# EAGLE design FilamentRecycle (EAGLE 6.6.0)

## Sheet 1 of 3
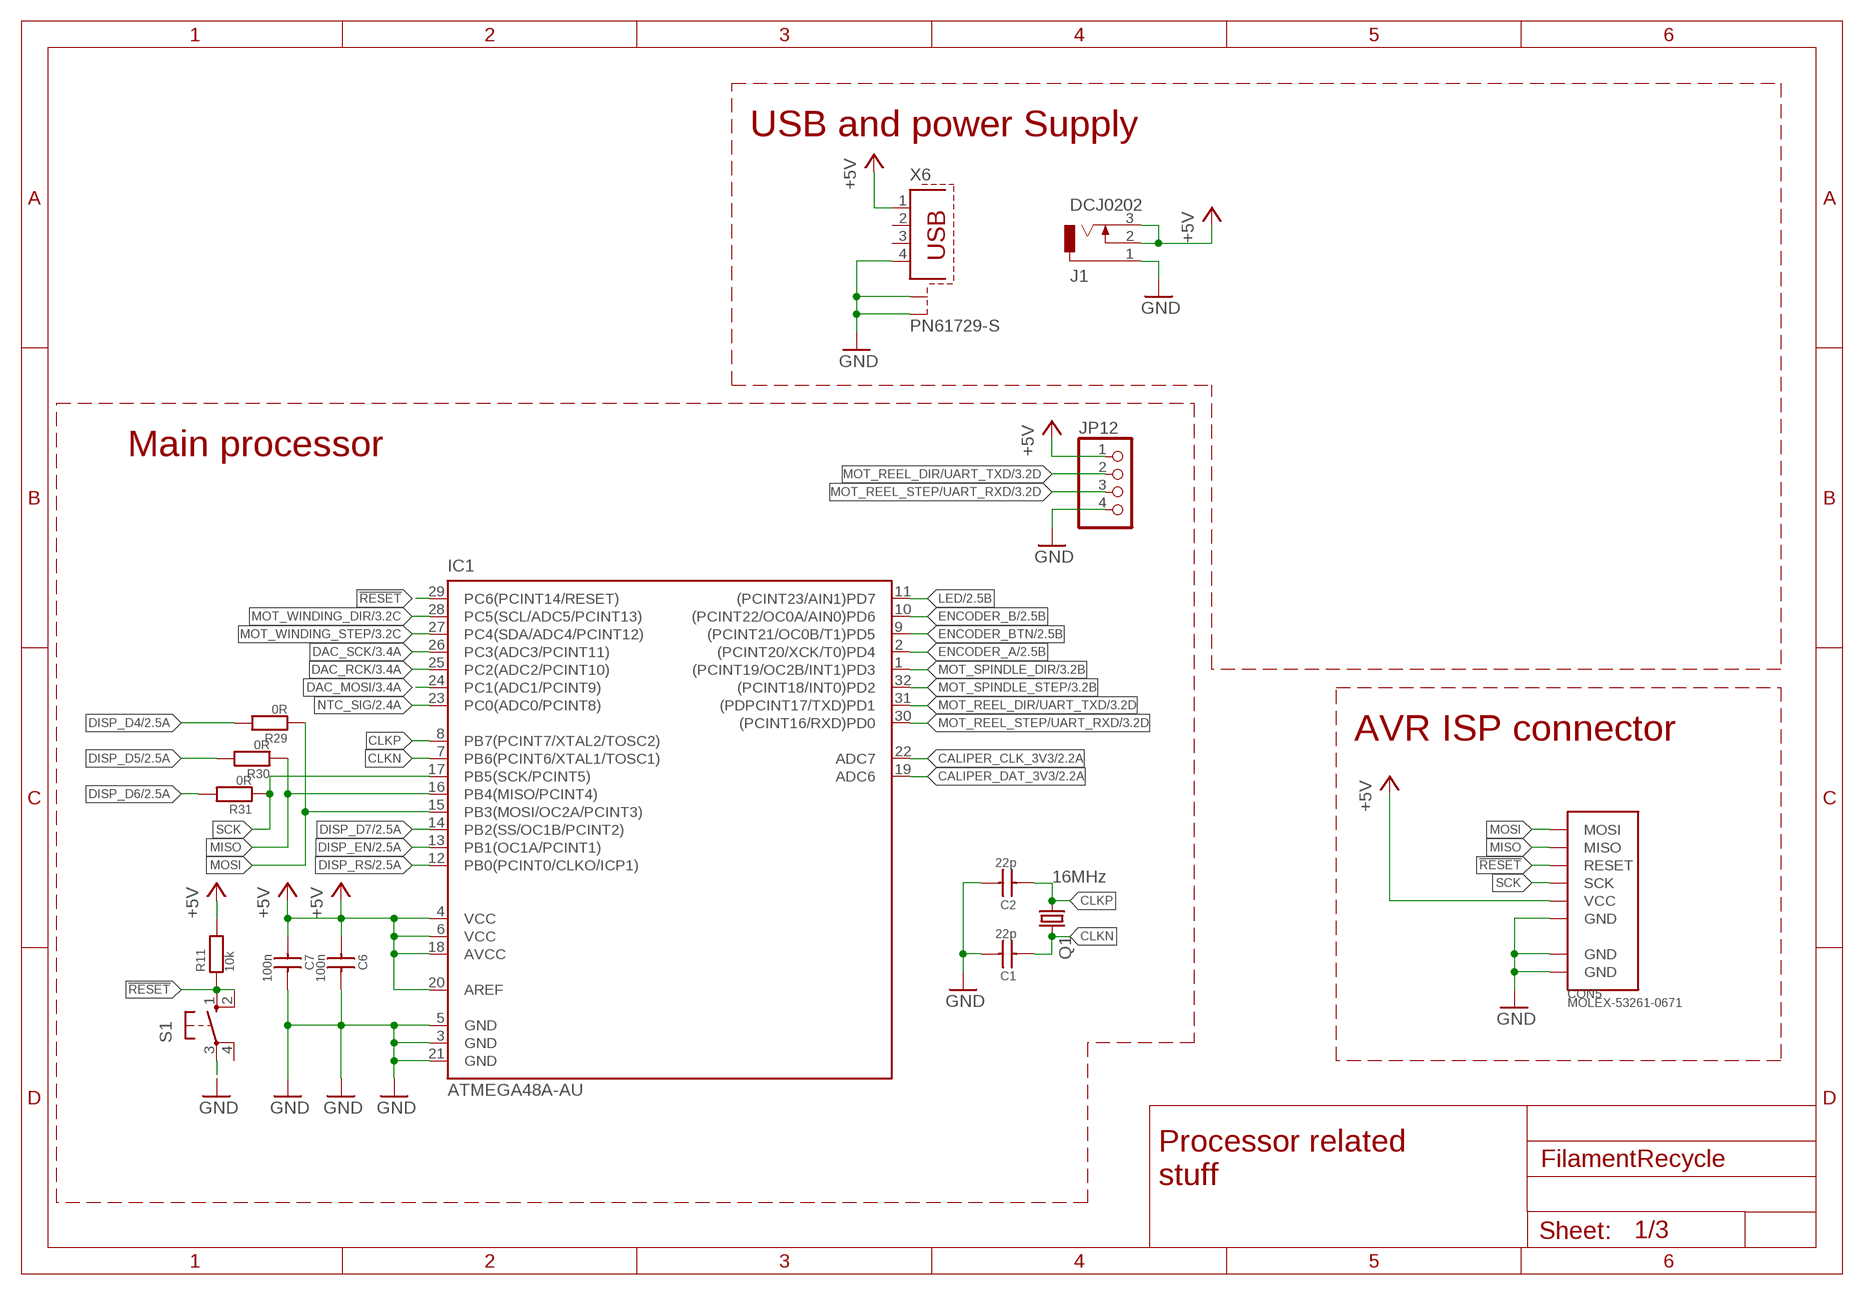
[diagram p0: schematic, sheet 1]

### Parts
C1  22p  C_SMD0603  [C0603]
C2  22p  C_SMD0603  [C0603]
C6  100n  C_SMD0603  [C0603]
C7  100n  C_SMD0603  [C0603]
CON5  MOLEX-53261-0671  [MOLEX-53261-0671]
IC1  ATMEGA48A-AU  [TQFP32]
J1  DCJ0202  [DCJ0202]
JP12  PINHD-1X4  [1X04]
Q1  16MHz  CRYSTALHC49UP  [HC49UP]
R11  10k  R0603  [R0603]
R29  0R  R0603  [R0603]
R30  0R  R0603  [R0603]
R31  0R  R0603  [R0603]
S1  10-XX  [B3F-10XX]
X6  PN61729-S  [PN61729-S]

### Nets
!RESET: CON5.3(RESET) IC1.29(PC6(PCINT14/RESET)) R11.1 S1.1(S) S1.2(S1)
+5V: C6.1 C7.1 CON5.5(VCC) IC1.4(VCC) IC1.6(VCC) IC1.18(AVCC) IC1.20(AREF) J1.2 J1.3 JP12.1 R11.2 X6.1 ; also sheet 2,3
CALIPER_CLK_3V3: IC1.22(ADC7) ; also sheet 2
CALIPER_DAT_3V3: IC1.19(ADC6) ; also sheet 2
CLKN: C1.1 IC1.7(PB6(PCINT6/XTAL1/TOSC1)) Q1.2
CLKP: C2.1 IC1.8(PB7(PCINT7/XTAL2/TOSC2)) Q1.1
DAC_MOSI: IC1.24(PC1(ADC1/PCINT9)) ; also sheet 3
DAC_RCK: IC1.25(PC2(ADC2/PCINT10)) ; also sheet 3
DAC_SCK: IC1.26(PC3(ADC3/PCINT11)) ; also sheet 3
DISP_D4: R29.2 ; also sheet 2
DISP_D5: R30.2 ; also sheet 2
DISP_D6: R31.2 ; also sheet 2
DISP_D7: IC1.14(PB2(SS/OC1B/PCINT2)) ; also sheet 2
DISP_EN: IC1.13(PB1(OC1A/PCINT1)) ; also sheet 2
DISP_RS: IC1.12(PB0(PCINT0/CLKO/ICP1)) ; also sheet 2
ENCODER_A: IC1.2((PCINT20/XCK/T0)PD4) ; also sheet 2
ENCODER_B: IC1.10((PCINT22/OC0A/AIN0)PD6) ; also sheet 2
ENCODER_BTN: IC1.9((PCINT21/OC0B/T1)PD5) ; also sheet 2
GND: C1.2 C2.2 C6.2 C7.2 CON5.6(GND) CON5.GND@1(GND) CON5.GND@2(GND) IC1.3(GND) IC1.5(GND) IC1.21(GND) J1.1 JP12.4 S1.3(P) X6.4 X6.S1 X6.S2 ; also sheet 2,3
LED: IC1.11((PCINT23/AIN1)PD7) ; also sheet 2
MISO: CON5.2(MISO) IC1.16(PB4(MISO/PCINT4)) R30.1
MOSI: CON5.1(MOSI) IC1.15(PB3(MOSI/OC2A/PCINT3)) R29.1
MOT_REEL_DIR/UART_TXD: IC1.31((PDPCINT17/TXD)PD1) JP12.2 ; also sheet 3
MOT_REEL_STEP/UART_RXD: IC1.30((PCINT16/RXD)PD0) JP12.3 ; also sheet 3
MOT_SPINDLE_DIR: IC1.1((PCINT19/OC2B/INT1)PD3) ; also sheet 3
MOT_SPINDLE_STEP: IC1.32((PCINT18/INT0)PD2) ; also sheet 3
MOT_WINDING_DIR: IC1.28(PC5(SCL/ADC5/PCINT13)) ; also sheet 3
MOT_WINDING_STEP: IC1.27(PC4(SDA/ADC4/PCINT12)) ; also sheet 3
NTC_SIG: IC1.23(PC0(ADC0/PCINT8)) ; also sheet 2
SCK: CON5.4(SCK) IC1.17(PB5(SCK/PCINT5)) R31.1
Unconnected: S1.4(P1) X6.2 X6.3

### Notes on the sheet
- USB and power Supply
- Main processor
- AVR ISP connector
- Processor related
  stuff

## Sheet 2 of 3
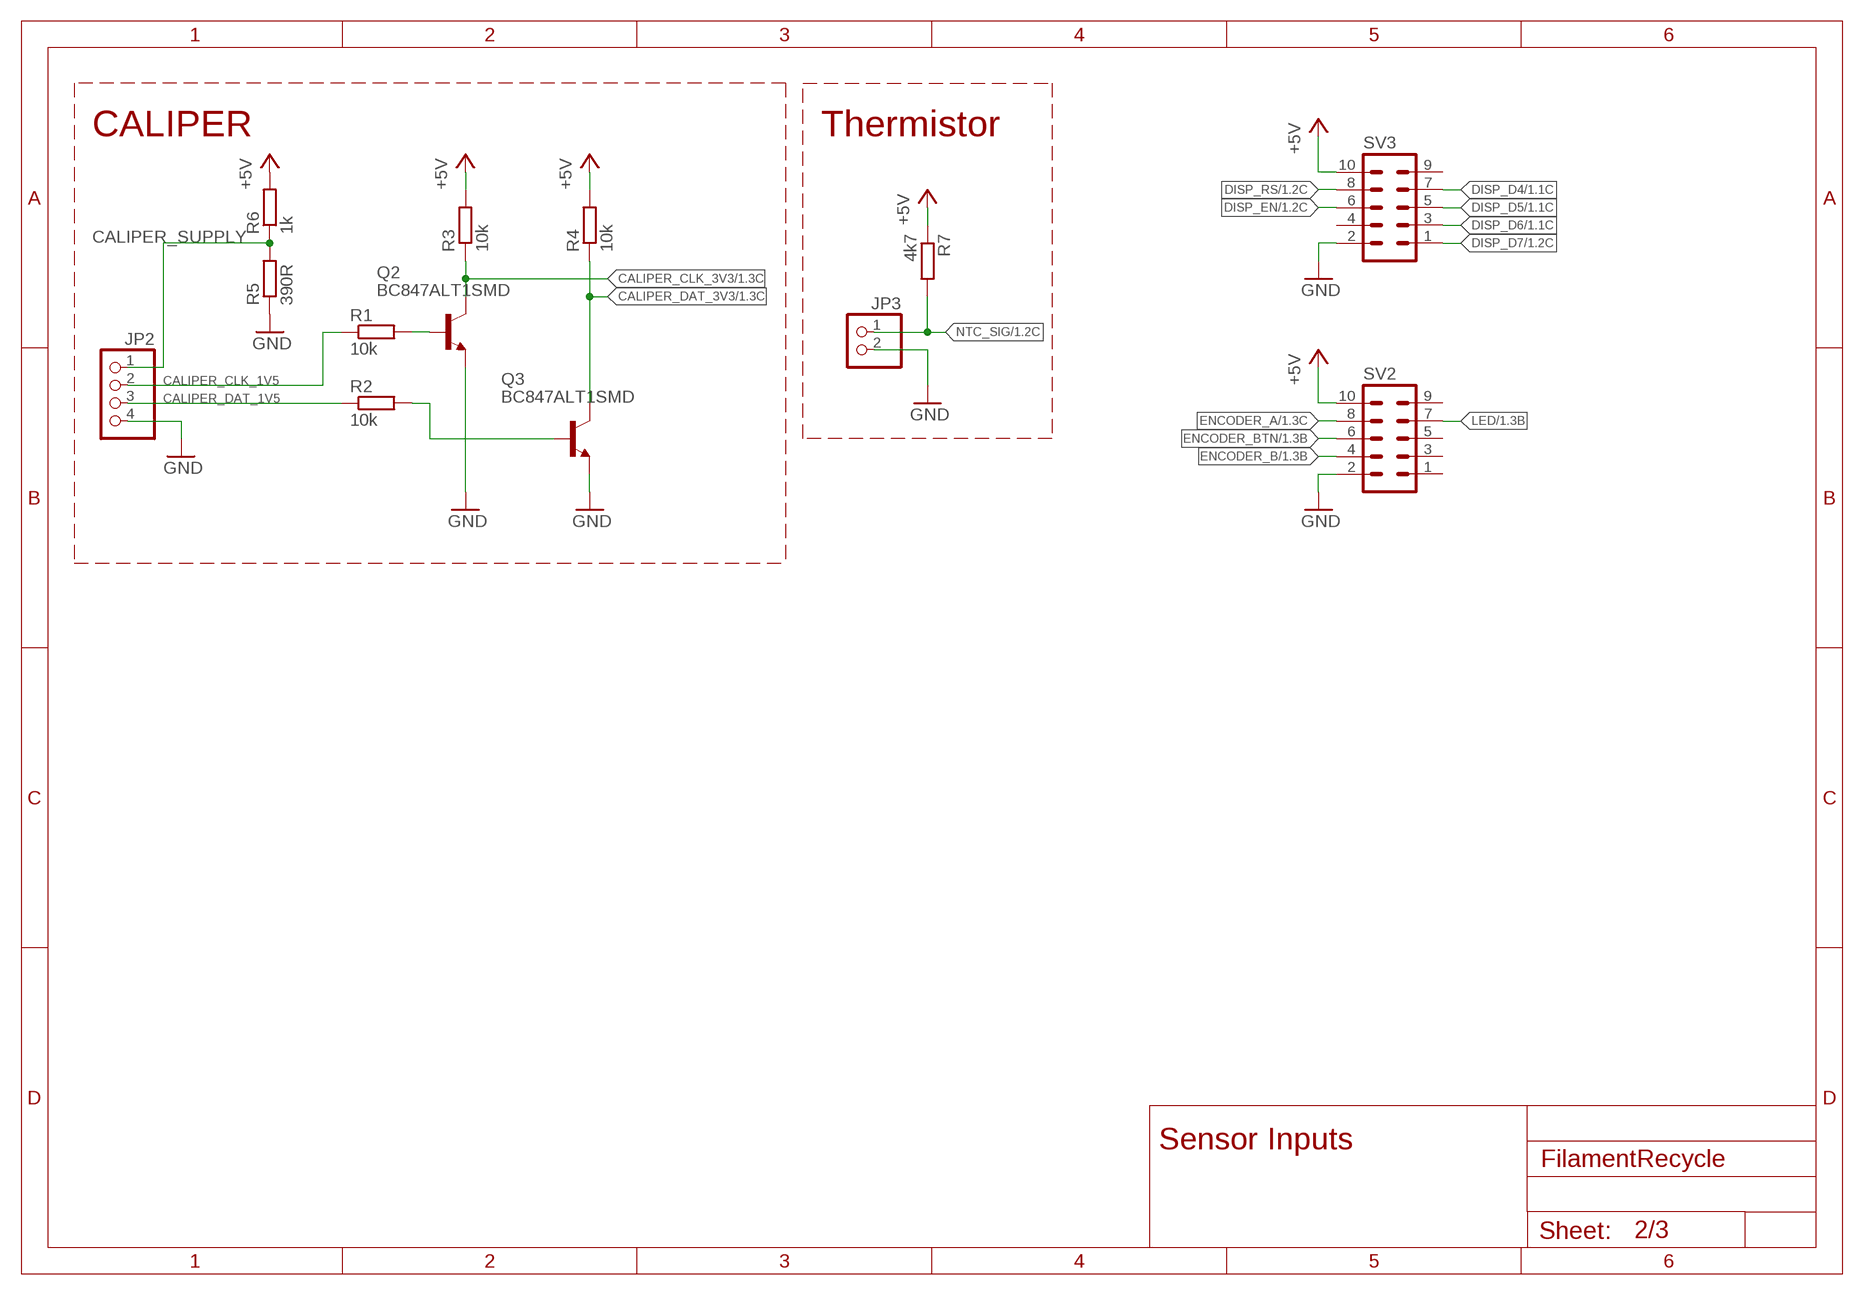
[diagram p1: schematic, sheet 2]

### Parts
JP2  PINHD-1X4  [1X04]
JP3  PINHD-1X2  [1X02]
Q2  BC847ALT1SMD  [SOT23]
Q3  BC847ALT1SMD  [SOT23]
R1  10k  R-EU_R0603  [R0603]
R2  10k  R-EU_R0603  [R0603]
R3  10k  R-EU_R0603  [R0603]
R4  10k  R-EU_R0603  [R0603]
R5  390R  R-EU_R0603  [R0603]
R6  1k  R-EU_R0603  [R0603]
R7  4k7  R-EU_R0603  [R0603]
SV2  ML10  [ML10]
SV3  ML10  [ML10]

### Nets
+5V: R3.2 R4.2 R6.2 R7.1 SV2.10 SV3.10 ; also sheet 1,3
CALIPER_CLK_1V5: JP2.2 R1.1
CALIPER_CLK_3V3: Q2.3(C) R3.1 ; also sheet 1
CALIPER_DAT_1V5: JP2.3 R2.1
CALIPER_DAT_3V3: Q3.3(C) R4.1 ; also sheet 1
CALIPER_SUPPLY: JP2.1 R5.2 R6.1
DISP_D4: SV3.7 ; also sheet 1
DISP_D5: SV3.5 ; also sheet 1
DISP_D6: SV3.3 ; also sheet 1
DISP_D7: SV3.1 ; also sheet 1
DISP_EN: SV3.6 ; also sheet 1
DISP_RS: SV3.8 ; also sheet 1
ENCODER_A: SV2.8 ; also sheet 1
ENCODER_B: SV2.4 ; also sheet 1
ENCODER_BTN: SV2.6 ; also sheet 1
GND: JP2.4 JP3.2 Q2.2(E) Q3.2(E) R5.1 SV2.2 SV3.2 ; also sheet 1,3
LED: SV2.7 ; also sheet 1
N$7: Q2.1(B) R1.2
N$9: Q3.1(B) R2.2
NTC_SIG: JP3.1 R7.2 ; also sheet 1
Unconnected: SV2.1 SV2.3 SV2.5 SV2.9 SV3.4 SV3.9

### Notes on the sheet
- CALIPER | Thermistor
- Sensor Inputs

## Sheet 3 of 3
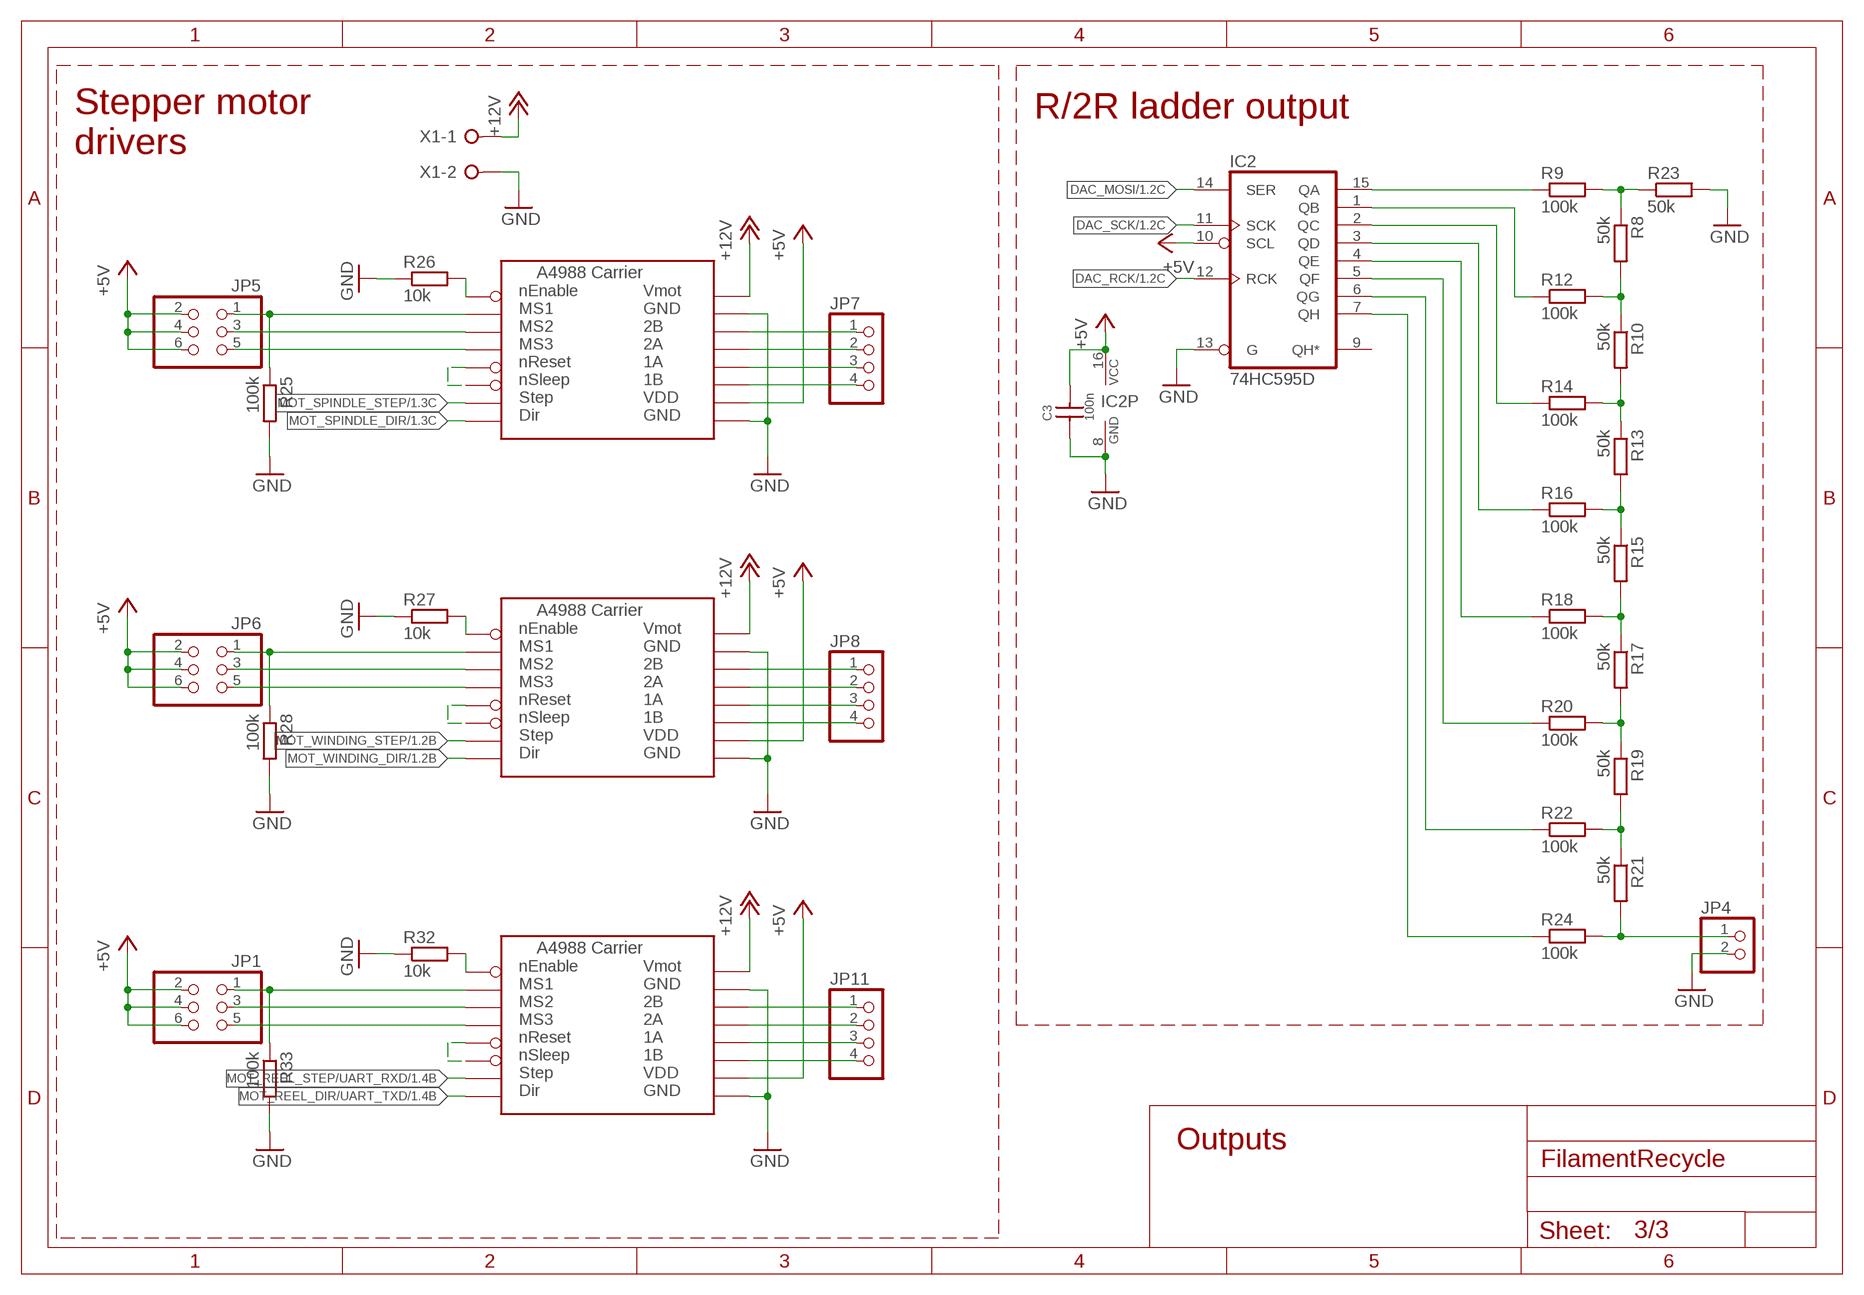
[diagram p2: schematic, sheet 3]

### Parts
C3  100n  C_SMD0603  [C0603]
IC2  74HC595D  [SO16]
JP1  PINHD-2X3  [2X03]
JP4  PINHD-1X2  [1X02]
JP5  PINHD-2X3  [2X03]
JP6  PINHD-2X3  [2X03]
JP7  PINHD-1X4  [1X04]
JP8  PINHD-1X4  [1X04]
JP11  PINHD-1X4  [1X04]
R8  50k  R-EU_R0603  [R0603]
R9  100k  R-EU_R0603  [R0603]
R10  50k  R-EU_R0603  [R0603]
R12  100k  R-EU_R0603  [R0603]
R13  50k  R-EU_R0603  [R0603]
R14  100k  R-EU_R0603  [R0603]
R15  50k  R-EU_R0603  [R0603]
R16  100k  R-EU_R0603  [R0603]
R17  50k  R-EU_R0603  [R0603]
R18  100k  R-EU_R0603  [R0603]
R19  50k  R-EU_R0603  [R0603]
R20  100k  R-EU_R0603  [R0603]
R21  50k  R-EU_R0603  [R0603]
R22  100k  R-EU_R0603  [R0603]
R23  50k  R-EU_R0603  [R0603]
R24  100k  R-EU_R0603  [R0603]
R25  100k  R-EU_R0603  [R0603]
R26  10k  R-EU_R0603  [R0603]
R27  10k  R-EU_R0603  [R0603]
R28  100k  R-EU_R0603  [R0603]
R32  10k  R-EU_R0603  [R0603]
R33  100k  R-EU_R0603  [R0603]
U$7  A4988BREAKOUT  [A4988BREAKOUT]
U$9  A4988BREAKOUT  [A4988BREAKOUT]
U$14  A4988BREAKOUT  [A4988BREAKOUT]
X1  W237-02P  [W237-132]

### Nets
!MOT_SPINDLE_EN: R26.2 U$7.EN
!MOT_WINDING_EN: R27.2 U$14.EN
!MOT_WINDING_EN1: R32.2 U$9.EN
+5V: C3.2 IC2.10(SCL) IC2.16(VCC) JP1.2 JP1.4 JP1.6 JP5.2 JP5.4 JP5.6 JP6.2 JP6.4 JP6.6 U$7.VDD U$9.VDD U$14.VDD ; also sheet 1,2
+12V: U$7.VMOT U$9.VMOT U$14.VMOT X1.1
DAC_MOSI: IC2.14(SER) ; also sheet 1
DAC_RCK: IC2.12(RCK) ; also sheet 1
DAC_SCK: IC2.11(SCK) ; also sheet 1
GND: C3.1 IC2.8(GND) IC2.13(G) JP4.2 R23.2 R25.2 R26.1 R27.1 R28.2 R32.1 R33.2 U$7.GND@0(GND) U$7.GND@1(GND) U$9.GND@0(GND) U$9.GND@1(GND) U$14.GND@0(GND) U$14.GND@1(GND) X1.2 ; also sheet 1,2
MOT_REEL_DIR/UART_TXD: U$9.DIR ; also sheet 1
MOT_REEL_STEP/UART_RXD: U$9.STEP ; also sheet 1
MOT_SPINDLE_DIR: U$7.DIR ; also sheet 1
MOT_SPINDLE_STEP: U$7.STEP ; also sheet 1
MOT_WINDING_DIR: U$14.DIR ; also sheet 1
MOT_WINDING_STEP: U$14.STEP ; also sheet 1
N$1: JP1.5 U$9.MS3
N$2: JP1.1 R33.1 U$9.MS1
N$3: JP4.1 R21.2 R24.2
N$4: R19.2 R21.1 R22.2
N$5: JP1.3 U$9.MS2
N$6: R17.2 R19.1 R20.2
N$8: JP11.1 U$9.2B
N$10: R15.2 R17.1 R18.2
N$11: R13.2 R15.1 R16.2
N$12: R10.2 R13.1 R14.2
N$13: R8.2 R10.1 R12.2
N$14: R8.1 R9.2 R23.1
N$15: IC2.15(QA) R9.1
N$16: IC2.1(QB) R12.1
N$17: IC2.2(QC) R14.1
N$18: IC2.3(QD) R16.1
N$19: IC2.4(QE) R18.1
N$20: IC2.5(QF) R20.1
N$21: IC2.6(QG) R22.1
N$22: IC2.7(QH) R24.1
N$23: JP5.5 U$7.MS3
N$24: U$7.RST U$7.SLP(SLEEP)
N$25: JP5.1 R25.1 U$7.MS1
N$26: JP5.3 U$7.MS2
N$27: JP7.1 U$7.2B
N$28: JP7.2 U$7.2A
N$29: JP7.3 U$7.1A
N$30: JP7.4 U$7.1B
N$31: JP11.2 U$9.2A
N$32: JP6.5 U$14.MS3
N$33: JP6.1 R28.1 U$14.MS1
N$34: JP6.3 U$14.MS2
N$35: JP8.1 U$14.2B
N$36: JP8.2 U$14.2A
N$37: JP8.3 U$14.1A
N$38: JP8.4 U$14.1B
N$39: U$14.RST U$14.SLP(SLEEP)
N$40: JP11.3 U$9.1A
N$41: JP11.4 U$9.1B
N$42: U$9.RST U$9.SLP(SLEEP)
Unconnected: IC2.9(QH*)

### Notes on the sheet
- R/2R ladder output
- Stepper motor 
  drivers
- Outputs

## Library data of the parts
C1-C3 C6 C7 = SchlegelAr_Master:C_SMD: C SMD 0402, 0603, 0805, 1206 last modified: Armin Schlegel, 24.03.2014
CON5 = SchlegelAr_Master:MOLEX-53261-0671: MOLEX-53261-0671 - Molex picoblade 53261-0671 6 pol last modified: Armin Schlegel, 28.04.2014 http://de.mouser.com/ProductDetail/Molex/53261-0671/?qs=%2Fha2pyFadujL8XqTNrjzA%2Fy0AZso5hx2IWE7X8dEAdsn1tpb%2FKahAA%3D%3D http://www.mouser.com/ds/2/276/0532610671_PCB_HEADERS-170915.pdf
IC1 = SchlegelAr_Master:ATMEGA48A-AU: ATMEGA48A-AU last modified: Armin Schlegel, 22.03.2014 http://de.mouser.com/ProductDetail/Atmel/ATMEGA48A-AU/?qs=sGAEpiMZZMvqv2n3s2xjse40PngS4U1xmCDanmh3raU%3D http://www.mouser.com/ds/2/36/doc8271-50296.pdf
IC2 = 74xx-eu:74*595: 8-bit SHIFT REGISTER, output latch
J1 = con-jack:DCJ0202: DC POWER JACK Source: DCJ0202.pdf; OC_FARNELL: unknown; OC_NEWARK: unknown
JP1 JP5 JP6 = pinhead:PINHD-2X3: PIN HEADER
JP2 JP7 JP8 JP11 JP12 = pinhead:PINHD-1X4: PIN HEADER
JP3 JP4 = pinhead:PINHD-1X2: PIN HEADER
Q1 = crystal:CRYSTAL: CRYSTAL; OC_FARNELL: unknown; OC_NEWARK: unknown
Q2 Q3 = transistor-npn:BC847*: NPN Transistor
R1-R10 R12-R28 R32 R33 = rcl:R-EU_: RESISTOR, European symbol
R11 R29-R31 = SchlegelAr_Master:R: Widerstaende in 0402, 0603, 0805, 1206, 2512 last modified: Armin Schlegel, 28.04.2014
S1 = switch-omron:10-XX: OMRON SWITCH; MPN: B3F-1000; OC_FARNELL: 176432; OC_NEWARK: 36M3542
SV2 SV3 = con-harting-ml:ML10: HARTING; OC_FARNELL: unknown; OC_NEWARK: unknown
U$7 U$9 U$14 = RepRapjr:A4988BREAKOUT
X1 = con-wago-508:W237-02P: WAGO SREW CLAMP; OC_FARNELL: unknown; OC_NEWARK: unknown
X6 = con-berg:PN61729-S: BERG USB connector; OC_FARNELL: unknown; OC_NEWARK: unknown

## Board
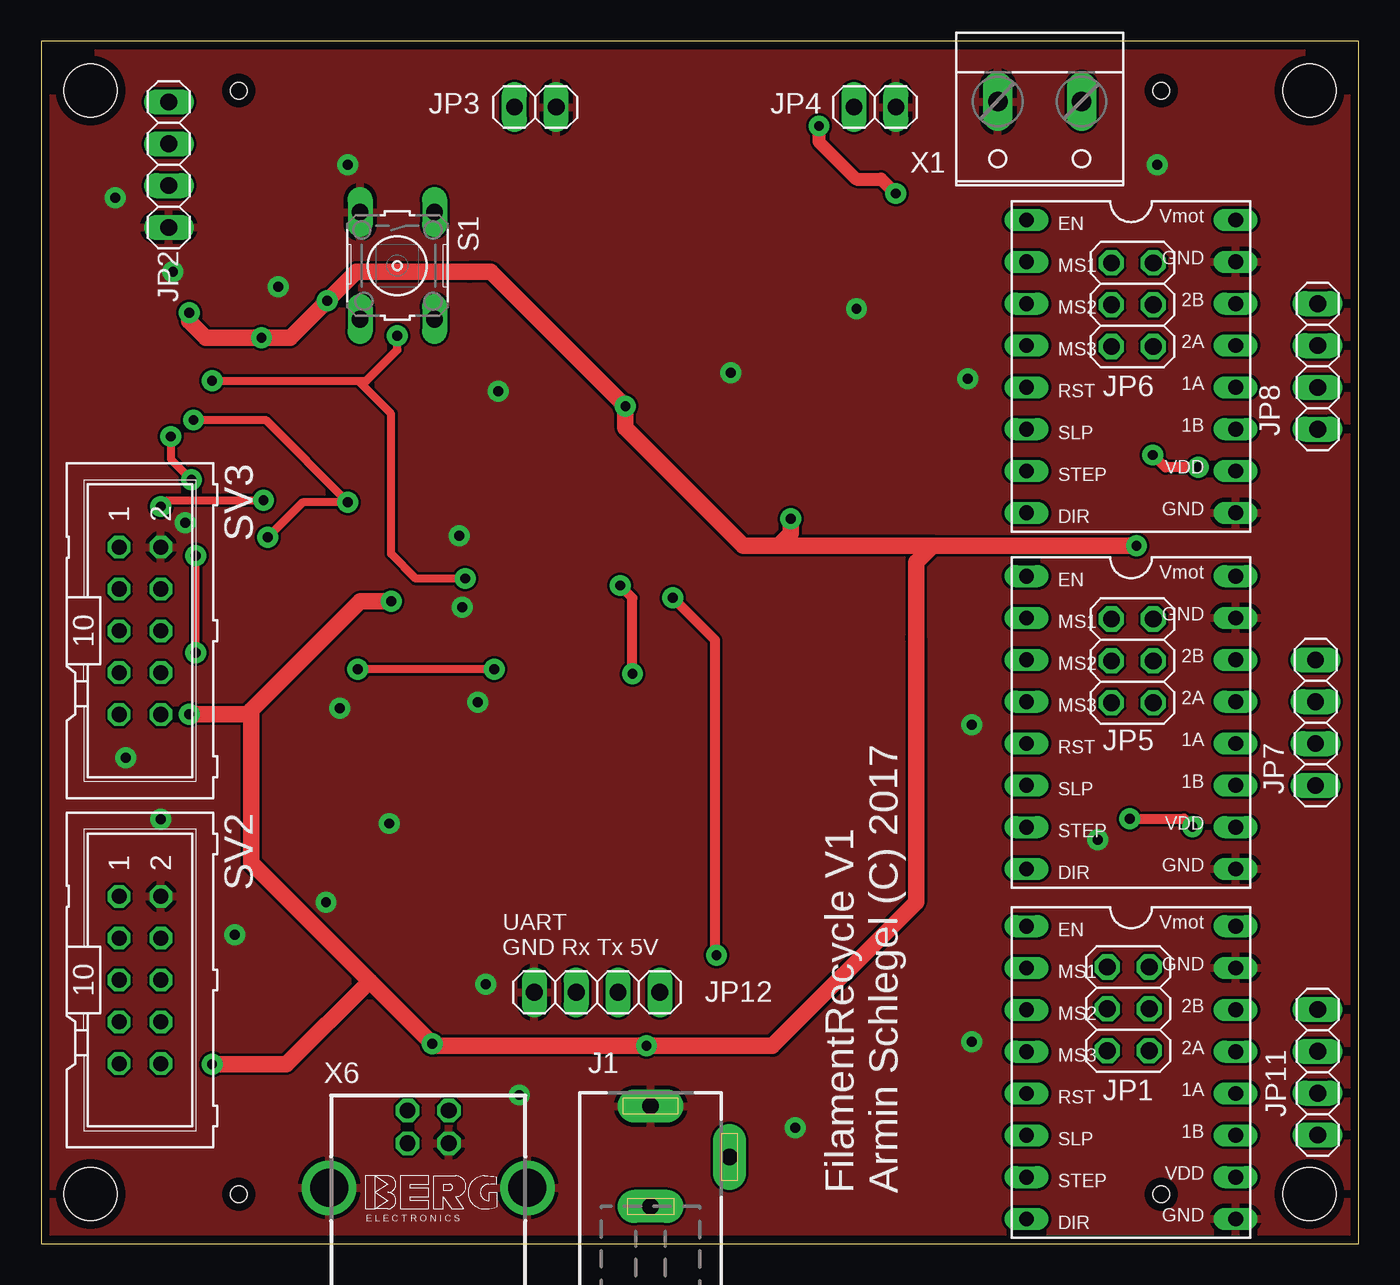
[diagram p3: board, top side]
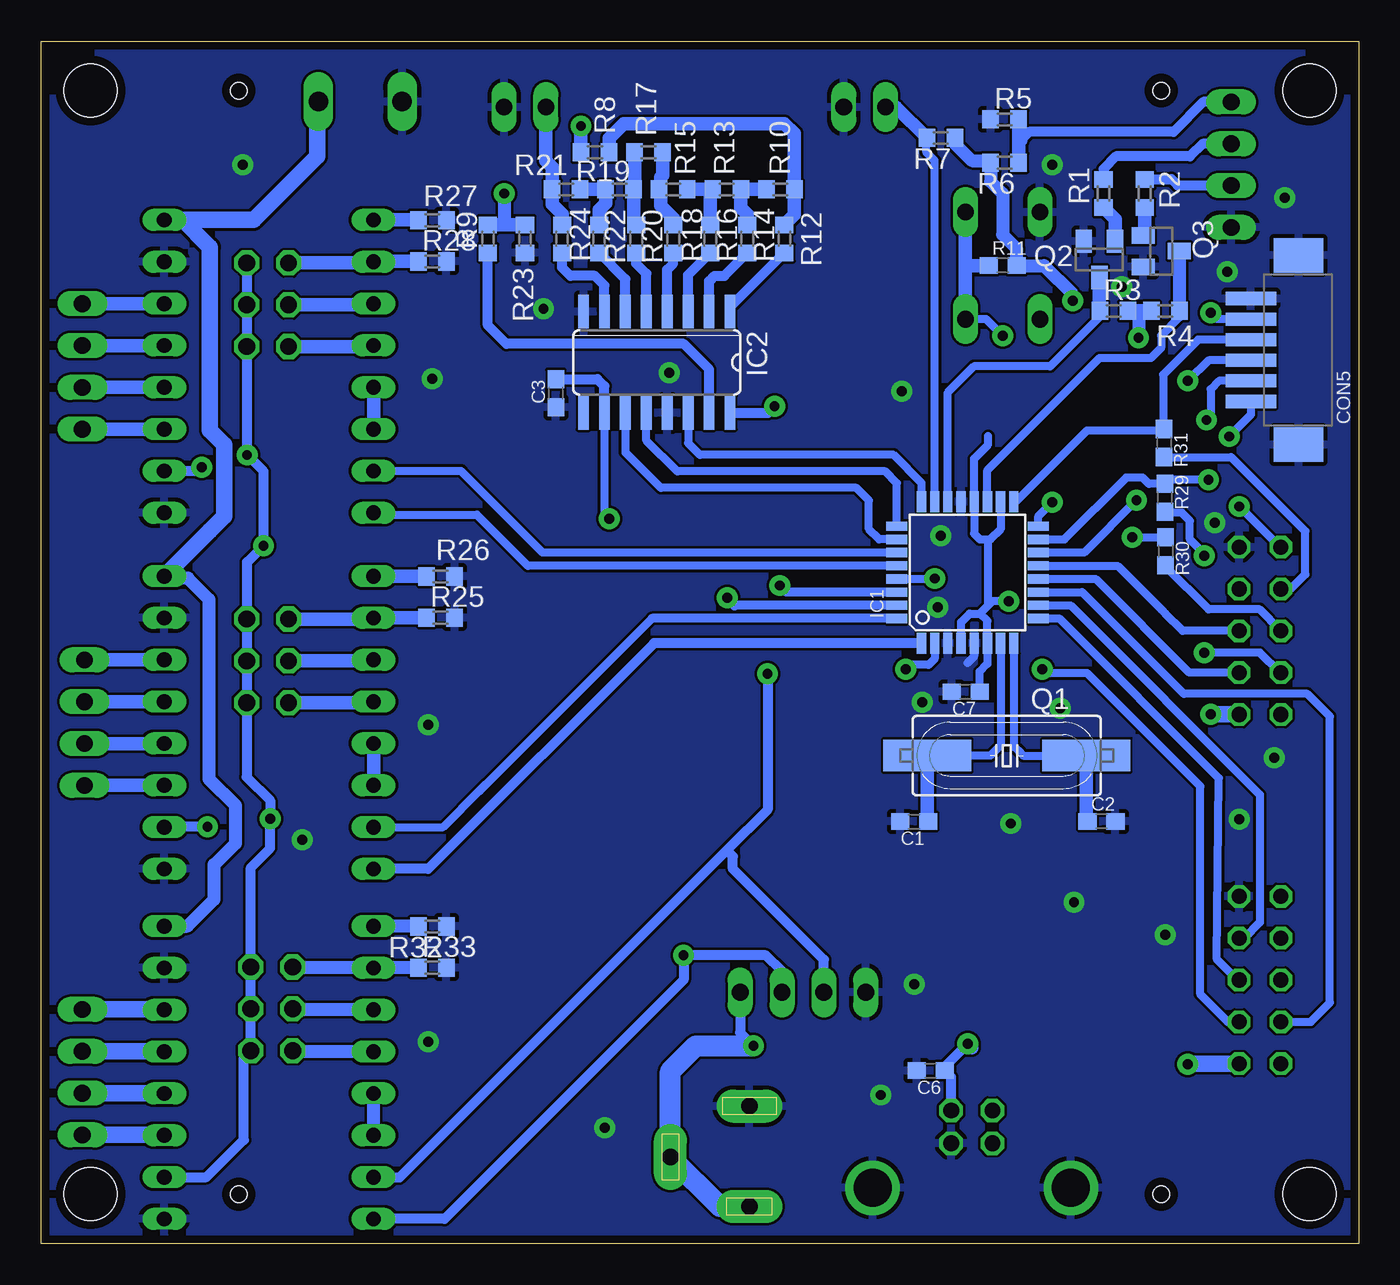
[diagram p4: board, bottom side, seen from below]

Size 80 x 73 mm. Coordinates in mm from the lower left corner, seen from the top.
Outline: 0,0 80,0 80,73 0,73 0,0
Copper layers (1*16): Top 0.035mm / dielectric 1.6mm / Bottom 0.035mm
Design rules "Elecrow_2-layer_PCB_eagle_rule": minimum track width 6mil, minimum drill 12mil, track to track 6mil, track to pad 6mil, pad to pad 6mil, via to via 8mil, smd to smd 0mil, copper to edge 20mil, drill to drill 10mil, minimum pad ring 6mil, minimum via ring 6mil, stop-mask expansion 0mil, vias tented up to drill 100mil, thermal gap 10mil
Holes 3.2 mm at 3,70 77,70 77,3 3,3
Holes 1 mm at 12,70 12,3 68,70 68,3

### Footprints (pad centres in the part's own frame; a part is rotated, then mirrored left to right if it is on the bottom)
C0603 = smd 1.1 x 1: 1 -0.85,0; 2 0.85,0
MOLEX-53261-0671 = smd 0.8 x 3.048: 1 -3.125,2.55; 2 -1.875,2.55; 3 -0.625,2.55; 4 0.625,2.55; 5 1.875,2.55; 6 3.125,2.55 | smd 2.1 x 3: GND@1 -5.75,-0.35; GND@2 5.75,-0.35
TQFP32 = smd 1.27 x 0.559: 1 -4.293,2.8; 2 -4.293,2; 3 -4.293,1.2; 4 -4.293,0.4; 5 -4.293,-0.4; 6 -4.293,-1.2; 7 -4.293,-2; 8 -4.293,-2.8; 17 4.293,-2.8; 18 4.293,-2; 19 4.293,-1.2; 20 4.293,-0.4; 21 4.293,0.4; 22 4.293,1.2; 23 4.293,2; 24 4.293,2.8 | smd 0.559 x 1.27: 9 -2.8,-4.293; 10 -2,-4.293; 11 -1.2,-4.293; 12 -0.4,-4.293; 13 0.4,-4.293; 14 1.2,-4.293; 15 2,-4.293; 16 2.8,-4.293; 25 2.8,4.293; 26 2,4.293; 27 1.2,4.293; 28 0.4,4.293; 29 -0.4,4.293; 30 -1.2,4.293; 31 -2,4.293; 32 -2.8,4.293
SO16 = smd 0.66 x 2.032: 1 -4.445,-3.073; 2 -3.175,-3.073; 3 -1.905,-3.073; 4 -0.635,-3.073; 5 0.635,-3.073; 6 1.905,-3.073; 7 3.175,-3.073; 8 4.445,-3.073; 9 4.445,3.073; 10 3.175,3.073; 11 1.905,3.073; 12 0.635,3.073; 13 -0.635,3.073; 14 -1.905,3.073; 15 -3.175,3.073; 16 -4.445,3.073
DCJ0202 = drill 1 pad 2 long: 1 0,3.1; 2 4.8,0; 3 0,-3
2X03 = drill 1.016 octagon: 1 -2.54,-1.27; 2 -2.54,1.27; 3 0,-1.27; 4 0,1.27; 5 2.54,-1.27; 6 2.54,1.27
1X04 = drill 1.016 long: 1 -3.81,0; 2 -1.27,0; 3 1.27,0; 4 3.81,0
1X02 = drill 1.016 long: 1 -1.27,0; 2 1.27,0
HC49UP = smd 5.334 x 1.93: 1 -4.826,0; 2 4.826,0
SOT23 = smd 1 x 1.4: 1 -0.95,-1.1; 2 0.95,-1.1; 3 0,1.1
R0603 = smd 1 x 1.1: 1 -0.85,0; 2 0.85,0
R0603' = smd 1.1 x 1: 1 -0.85,0; 2 0.85,0
B3F-10XX = drill 1.016 long: 1 -3.251,2.261; 2 3.251,2.261; 3 -3.251,-2.261; 4 3.251,-2.261
ML10 = drill 0.914 octagon: 1 -5.08,-1.27; 2 -5.08,1.27; 3 -2.54,-1.27; 4 -2.54,1.27; 5 0,-1.27; 6 0,1.27; 7 2.54,-1.27; 8 2.54,1.27; 9 5.08,-1.27; 10 5.08,1.27
A4988BREAKOUT = drill 0.9 long: 1A 8.89,1.27; 1B 11.43,1.27; 2A 6.35,1.27; 2B 3.81,1.27; DIR 16.51,-11.43; EN -1.27,-11.43; GND@0 1.27,1.27; GND@1 16.51,1.27; MS1 1.27,-11.43; MS2 3.81,-11.43; MS3 6.35,-11.43; RST 8.89,-11.43; SLP 11.43,-11.43; STEP 13.97,-11.43; VDD 13.97,1.27; VMOT -1.27,1.27
W237-132 = drill 1.194 long: 1 -2.54,-0.635; 2 2.54,-0.635
PN61729-S = drill 0.95 octagon: 1 1.25,4.71; 2 -1.25,4.71; 3 -1.25,2.71; 4 1.25,2.71 | drill 2.3 pad 2.9: S1 -6.02,0; S2 6.02,0

### Placement (x,y rotation side)
C1  27,25.62 180 bottom
C2  15.62,25.62 0 bottom
C3  48.75,51.62 90 bottom
C6  26,10.5 180 bottom
C7  23.88,33.5 180 bottom
CON5  4,54.25 90 bottom
IC1  23.75,40.75 90 bottom
IC2  42.62,53.5 180 bottom
J1  37,5.25 0 top
JP1  66,14.25 270 top
JP2  7.75,65.5 270 top
JP3  30,69 0 top
JP4  50.62,69 0 top
JP5  66.25,35.38 270 top
JP6  66.25,57 270 top
JP7  77.38,31.62 270 top
JP8  77.5,53.25 270 top
JP11  77.5,10.4 270 top
JP12  33.75,15.25 180 top
Q1  21.38,29.62 180 bottom
Q2  15.75,59.75 180 bottom
Q3  12,60.25 270 bottom
R1  15.5,63.75 270 bottom
R2  13,63.75 270 bottom
R3  14.88,56.62 0 bottom
R4  11.75,56.62 180 bottom
R5  21.5,68.25 0 bottom
R6  21.5,65.62 180 bottom
R7  25.38,67.12 180 bottom
R8  46.38,66.25 0 bottom
R9  52.88,61 90 bottom
R10  35.12,64 180 bottom
R11  10k  [R0603']  21.62,59.38 0 bottom
R12  34.88,61 90 bottom
R13  38.38,64 180 bottom
R14  37.12,61 90 bottom
R15  41.62,64 180 bottom
R16  39.38,61 90 bottom
R17  43.12,66.25 180 bottom
R18  41.62,61 90 bottom
R19  44.88,64 180 bottom
R20  43.88,61 90 bottom
R21  48.12,64 180 bottom
R22  46.12,61 90 bottom
R23  50.62,61 270 bottom
R24  48.38,61 90 bottom
R25  55.75,38 0 bottom
R26  55.75,40.5 180 bottom
R27  56.25,62.12 180 bottom
R28  56.25,59.62 0 bottom
R29  0R  [R0603']  11.78,45.27 270 bottom
R30  0R  [R0603']  11.72,42.02 270 bottom
R31  0R  [R0603']  11.82,48.6 270 bottom
R32  56.25,19.25 180 bottom
R33  56.25,16.75 0 bottom
S1  21.62,59.38 270 top
SV2  6,16 270 top
SV3  6,37.2 270 top
U$7  71.25,39.25 270 top
U$9  71.25,18 270 top
U$14  71.25,60.88 270 top
X1  60.62,68.7 180 top
X6  23.5,3.38 0 top

### Tracks (layer width: path | path; a pad name or v marks a point on that pad's centre or on a via)
!MOT_SPINDLE_EN
  Bottom 0.813: U$7.EN 56.62,40.52 R26.2
!MOT_WINDING_EN
  Bottom 0.813: U$14.EN 57.12,62.15 R27.2
!MOT_WINDING_EN1
  Bottom 0.8: R32.2 59.8,19.25 U$9.EN
!RESET  (via drill 0.6 pad 1.27)
  Top 0.5: v21.62,55.12 21.62,54.25 19.75,52.38 19.25,52.38 | v10.38,52.38 19.25,52.38 | v25.75,40.38 22.75,40.38 21.25,41.88 21.25,50.38 19.25,52.38
  Bottom 0.5: IC1.29 25.77,40.35 v25.75,40.38 | v21.62,55.12 22.62,56.12 S1.2 | CON5.3 9.12,53.62 v10.38,52.38
  Bottom 0.813: S1.2 23.89,59.25 | 23.89,59.25 S1.1 | R11.1 23.76,59.38 23.89,59.25
+5V  (via drill 0.6 pad 1.27)
  Top 0.6: v70.25,47.12 68.25,47.12 v67.5,47.88 | v66.1,25.8 69.4,25.8 v69.9,25.3
  Top 1: v21.25,39 19.38,39 12.75,32.38 12.75,32.12 | 12.75,32.12 12.75,23.12 19.94,15.94 | 19.94,15.94 v23.75,12.12 | v10.38,10.88 14.88,10.88 19.94,15.94 | v9,32.12 12.75,32.12 | v9,56.5 9,56 10,55 v13.38,55 15.12,55 v17.38,57.25 19.12,59 26,59 | 53.12,36.75 53.12,41.38 54.12,42.38 v66.5,42.38
  Top 1.016: 54.12,42.38 44.75,42.38 | 44.75,42.38 42.62,42.38 35.47,49.53 v35.47,50.83 27.3,59 26,59 | 53.12,36.75 53.12,20.73 44.4,12 v36.75,12 23.88,12 v23.75,12.12 | v45.5,44 45.5,43.12 44.75,42.38
  Bottom 0.5: IC1.18 21.75,43.38 22.38,42.75 22.5,42.75 | 22.5,42.75 23,42.75 23.35,43.1 IC1.20 23.35,47.65 22.5,48.5 22.5,49.02 | IC1.4 24.15,37.73 23.62,38.25 23,38.25 | 23,38.25 22.5,38.75 | 22.5,38.75 22.5,42.75 | 23,38.25 22.55,37.8 IC1.6 22.55,35.2 23.02,34.73 C7.1 | v21.25,39 22.25,39 22.5,38.75 | 45.8,51.95 IC2.10 45.8,44.3 v45.5,44 | CON5.5 8.62,56.12 v9,56.5
  Bottom 0.6: C3.2 46.23,52.48 45.8,52.05 IC2.10 | 67.5,59.56 JP6.2 JP6.4 JP6.6 67.5,54.44 v67.5,47.88 66.5,46.88 v66.5,42.38 67.5,41.38 67.5,37.94 JP5.2 JP5.4 JP5.6 67.52,28.32 66.1,26.9 v66.1,25.8 66.1,24 67.27,22.83 JP1.2 | 72.36,25.12 U$7.VDD 72.5,25.3 v69.9,25.3 | U$14.VDD 70.47,46.91 v70.25,47.12 | JP12.1 37.56,12.81 v36.75,12
  Bottom 0.61: JP1.2 JP1.4 JP1.6 67.7,11.28 67.7,6.3 69.97,4.03 U$9.VDD | 23.62,12 v23.75,12.12 25.15,10.72 C6.1 24.75,10.1 X6.1 | IC2.16 35.87,50.43 v35.47,50.83
  Bottom 0.8: R7.1 24.52,66.78 23.5,65.75 22.48,65.75 R6.2 22.35,64.47 21.62,63.75 21.62,61.25 20.77,60.4 R11.2 19.12,59.38 17.38,57.62 v17.38,57.25 | R4.2 R3.2 13.62,56.62 13.38,56.38 v13.38,55 | 23.75,12.21 v23.75,12.12 23.5,11.88
  Bottom 1: SV2.10 10.33,10.92 v10.38,10.88 | SV3.10 8.62,32.12 v9,32.12
  Bottom 1.27: J1.3 38.8,2.25 J1.2 41.8,10.45 40.25,12 v36.75,12
+12V
  Bottom 0.8: U$9.VMOT 71.13,19.27 69.5,20.9 69.5,23 68.2,24.3 68.2,26.6 69.8,28.2 69.8,39.1 71.1,40.4 72.4,40.4 U$7.VMOT
  Bottom 1: 69.75,43.29 68.88,44.16 68.88,48.5 69.75,49.38 69.75,60.5
  Bottom 1.016: U$7.VMOT 69.75,43.29 | 69.75,60.5 71.39,62.15 | 71.39,62.15 U$14.VMOT | 71.39,62.15 67.11,62.15 63.25,66 63.25,69.25 X1.1
CALIPER_CLK_1V5
  Bottom 0.61: JP2.2 9.48,66.77 10.25,66 14.75,66 15.5,65.25 R1.1
  Bottom 0.813: 15.52,64.62 R1.1
CALIPER_CLK_3V3
  Bottom 0.5: IC1.22 24.95,51.67 23.38,53.25 18.75,53.25 15.75,56.25 15.75,56.65
  Bottom 0.813: Q2.3 15.75,56.65 R3.1
CALIPER_DAT_1V5
  Bottom 0.61: 12.98,64.62 11.37,64.62 11,64.25 7.77,64.25 JP2.3
  Bottom 0.813: 12.98,64.62 R2.1
CALIPER_DAT_3V3
  Bottom 0.5: IC1.19 22.55,46.95 15.75,53.75 12.62,53.75 12,54.38 12,55.12 10.9,56.23 R4.1
  Bottom 0.8: Q3.3 R4.1
CALIPER_SUPPLY
  Bottom 0.61: JP2.1 9.44,69.31 11.25,67.5 20.02,67.5 20.52,67 | 20.75,68.35 R5.2
  Bottom 0.813: R6.1 20.65,66.88 | 20.65,66.88 R5.2 | 20.52,67 20.65,66.88
CLKN
  Bottom 0.5: Q1.2 22.38,29.62 21.75,30.25 IC1.7
  Bottom 0.813: Q1.2 26.2,25.68 C1.1
CLKP
  Bottom 0.5: Q1.1 20.38,29.62 20.69,29.94 20.95,30.2 IC1.8
  Bottom 0.813: Q1.1 16.55,25.7 C2.1
DAC_MOSI
  Bottom 0.5: IC1.24 26.55,46.17 28.25,47.88 40,47.88 40.72,48.59 IC2.14
DAC_RCK
  Bottom 0.5: IC1.25 28.04,46.17 28.75,46.88 41.38,46.88 43.25,48.75 43.25,50.42 IC2.12
DAC_SCK
  Bottom 0.5: IC1.26 29.12,42.75 29.75,43.38 29.75,45.12 30.5,45.88 42.38,45.88 44.53,48.03 IC2.11
DISP_D4  (via drill 0.6 pad 1.27)
  Top 0.5: v9.38,35.88 v9.38,41.75
  Bottom 0.5: SV3.7 4.79,34.66 6,35.88 v9.38,35.88 | R29.2 11.72,44.38 10.75,44.38 10.25,43.88 10.25,42.75 9.38,41.88 v9.38,41.75
DISP_D5
  Bottom 0.5: SV3.5 6.03,38.5 9.12,38.5 11.72,41.1 R30.2 11.55,41
DISP_D6
  Bottom 0.5: SV3.3 4.13,39.74 3.25,40.62 3.25,43.25 7.75,47.75 R31.2
DISP_D7  (via drill 0.6 pad 1.27)
  Top 0.5: v7.25,44.75 7.62,45.12 v13.5,45.12
  Bottom 0.5: SV3.1 4.78,42.28 v7.25,44.75 | v13.5,45.12 16.68,41.95 IC1.14
DISP_EN
  Bottom 0.5: IC1.13 14.65,41.15 12,38.5 11.75,38.25 10.7,37.2 SV3.6
DISP_RS
  Bottom 0.5: IC1.12 15.97,40.35 10.29,34.66 SV3.8
ENCODER_A  (via drill 0.6 pad 1.27)
  Top 0.5: v27.5,34.88 v19.23,34.88
  Bottom 0.5: IC1.2 25.75,35.5 26.12,35.12 27.25,35.12 v27.5,34.88 | SV2.8 7.96,13.46 9.62,15.12 9.62,27.75 16.5,34.62 18.98,34.62 v19.23,34.88
ENCODER_B
  Bottom 0.5: IC1.10 17.5,38.75 6,27.25 6,19.5 6.96,18.54 SV2.4
ENCODER_BTN
  Bottom 0.5: SV2.6 7.38,16 8.62,17.25 8.5,28.25 18.2,37.95 IC1.9
GND  (via drill 0.6 pad 1.27)
  Bottom 0.5: IC1.5 23.35,35.65 23.75,35.25
  other vias: 18.62,65.5 14.4,58.1 49.5,56.75 41.88,52.88 67.75,65.5 26.5,32.88 25.57,38.62 25.38,42.98 21.12,25.5 11.75,18.75 17.3,20.72 29.03,9.02 64.15,24.52 5.12,29.5 18.12,32.5 4.5,63.5 8,59 27.75,51.75 27,15.75 56.5,31.5 56.25,52.5 56.5,12.25 7.25,25.75 8.75,43.75 45.78,7.02
  pour Bottom: 0.12,73 80,73 80,-0.12 0.12,-0.12
  pour Top: 0,73 80,73 80,0 0,0
LED
  Bottom 0.5: SV2.7 2.92,13.46 1.75,14.62 1.75,32 3.12,33.38 10.62,33.38 16.8,39.55 IC1.11
MISO  (via drill 0.6 pad 1.27)
  Top 0.5: v13.75,42.88 15.88,45 v18.62,45 13.62,50 v9.25,50
  Bottom 0.5: IC1.16 19.46,44.17 v18.62,45 | v13.75,42.88 R30.1 | CON5.2 8.5,52.38 9,51.88 9,50.25 v9.25,50
MOSI  (via drill 0.6 pad 1.27)
  Top 0.5: v7.88,49 7.88,47.62 v9.12,46.38
  Bottom 0.5: IC1.15 17.88,42.75 14.12,46.5 13.12,46.5 12.75,46.12 R29.1 11.53,46.38 v9.12,46.38 | CON5.1 6.55,50.33 v7.88,49
MOT_REEL_DIR/UART_TXD  (via drill 0.6 pad 1.27)
  Top 0.6: v41,17.5 40.9,17.6 40.9,36.65 v38.35,39.2
  Bottom 0.55: IC1.31 37.9,38.75
  Bottom 0.6: U$9.DIR 55.5,1.5 41,16 v41,17.5 36,17.5 35.02,16.52 JP12.2 | 37.9,38.75 v38.35,39.2
MOT_REEL_STEP/UART_RXD  (via drill 0.6 pad 1.27)
  Top 0.6: v35.9,34.6 35.9,39.2 v35.15,39.95
  Bottom 0.55: IC1.30 34.75,39.55 v35.15,39.95
  Bottom 0.6: v35.9,34.6 35.9,26.35 38.38,23.88 | 38.38,23.88 58.25,4 59.79,4 U$9.STEP | JP12.3 32.48,17.23 38,22.75 38,23.5 38.38,23.88
MOT_SPINDLE_DIR
  Bottom 0.6: IC1.1 42.79,36.46 56.51,22.74 U$7.DIR
MOT_SPINDLE_STEP
  Bottom 0.5: 53,27.88 53.39,27.49 | 53.39,27.49 55.59,25.28 U$7.STEP | 42.9,37.95 53.36,27.49 53.39,27.49
  Bottom 0.55: IC1.32 42.9,37.95
MOT_WINDING_DIR
  Bottom 0.5: IC1.28 50.45,41.15 53.55,44.25 59.7,44.25 U$14.DIR
MOT_WINDING_STEP
  Bottom 0.5: IC1.27 49.55,41.95 54.45,46.85 54.5,46.9 54.51,46.91 U$14.STEP 59.79,46.88
N$1
  Bottom 0.8: U$9.MS3 64.67,11.65 JP1.5
N$2
  Bottom 0.8: R33.1 59.8,16.75 U$9.MS1 64.67,16.73 JP1.1
N$3
  Bottom 0.813: R24.2 48.38,62.5 48.98,63.1 R21.2 48.98,65.35 49.38,65.75 49.38,66.73 JP4.1
N$4
  Bottom 0.813: R22.2 46.12,62.75 45.73,63.15 R19.2 R21.1
N$5
  Bottom 0.8: U$9.MS2 64.67,14.19 JP1.3
N$6
  Bottom 0.813: R17.2 43.98,64.05 R19.1 44.02,62 R20.2
N$7
  Bottom 0.813: Q2.1 14.8,62.2 R1.2
N$8
  Bottom 1.016: JP11.1 72.54,14.21 U$9.2B
N$9
  Bottom 0.813: R2.2 13,61.3 Q3.1
N$10
  Bottom 0.813: R18.2 41.62,62.25 42.38,63 42.38,63.9 R15.2 42.38,64.1 42.38,64.75 42.27,64.85 R17.1
N$11
  Bottom 0.813: R16.2 39.38,64 R13.2 R15.1
N$12
  Bottom 0.813: R14.2 37.12,62.5 37.52,62.9 R13.1 R10.2
N$13
  Bottom 0.813: R12.2 34.27,62.45 R10.1 34.27,67.4 34.88,68 44.62,68 45.52,67.1 R8.2
N$14  (via drill 0.6 pad 1.27)
  Top 0.8: v47.23,67.85 47.23,66.9 49.5,64.62 51,64.62 v51.88,63.75
  Bottom 0.8: v51.88,63.75 51.88,61.98 51.75,61.85
  Bottom 0.813: 50.52,61.95 R23.1 51.75,61.85 R9.2 | R8.1 v47.23,67.85
N$15
  Bottom 0.6: 39.45,53.08 41,54.62 51.75,54.62 52.88,55.75
  Bottom 0.61: IC2.15 39.45,53.08 | 52.88,55.75 R9.1
N$16
  Bottom 0.61: IC2.1 38.18,56.84 R12.1
N$17
  Bottom 0.61: IC2.2 39.45,58.42 39.12,58.75 38.52,58.75 R14.1
N$18
  Bottom 0.61: IC2.3 40.72,58.8 R16.1
N$19
  Bottom 0.61: IC2.4 41.99,59.13 41.62,59.5 R18.1
N$20
  Bottom 0.61: IC2.5 43.26,58.88 43.88,59.5 R20.1
N$21
  Bottom 0.61: IC2.6 44.53,58.55 R22.1
N$22
  Bottom 0.61: IC2.7 45.8,58.17 46.38,58.75 47.88,58.75 48.38,59.25 R24.1
N$23
  Bottom 0.813: JP5.5 59.88,32.84 U$7.MS3
N$24
  Bottom 0.813: U$7.SLP U$7.RST
N$25
  Bottom 0.813: R25.1 56.62,37.98 U$7.MS1 59.88,37.91 JP5.1
N$26
  Bottom 0.813: JP5.3 59.88,35.38 U$7.MS2
N$27
  Bottom 0.813: JP7.1 U$7.2B
N$28
  Bottom 0.813: JP7.2 U$7.2A
N$29
  Bottom 0.813: JP7.3 U$7.1A
N$30
  Bottom 0.813: JP7.4 U$7.1B
N$31
  Bottom 1.016: JP11.2 72.54,11.67 U$9.2A
N$32
  Bottom 0.813: JP6.5 59.88,54.46 U$14.MS3
N$33
  Bottom 0.813: R28.1 59.8,59.62 U$14.MS1 59.88,59.54 JP6.1
N$34
  Bottom 0.813: JP6.3 59.88,57 U$14.MS2
N$35
  Bottom 0.813: JP8.1 U$14.2B
N$36
  Bottom 0.813: JP8.2 U$14.2A
N$37
  Bottom 0.813: JP8.3 U$14.1A
N$38
  Bottom 0.813: JP8.4 U$14.1B
N$39
  Bottom 0.813: U$14.SLP U$14.RST
N$40
  Bottom 1.016: JP11.3 72.54,9.13 U$9.1A
N$41
  Bottom 1.016: JP11.4 72.54,6.59 U$9.1B
N$42
  Bottom 0.8: U$9.SLP U$9.RST
NTC_SIG
  Bottom 0.5: IC1.23 25.75,65.75 26.25,66.25 26.25,67.1 R7.2
  Bottom 0.8: JP3.1 28.1,69 R7.2
SCK
  Bottom 0.5: IC1.17 20.83,45.04 16.5,49.38 11.9,49.38 R31.1 11.88,49.5 11.88,52.75 9.75,54.88 CON5.4

### Text on the board
tNames: UART / GND Rx Tx 5V | FilamentRecycle V1 / Armin Schlegel (C) 2017